# EAGLE schematic USB_Dimensioned (EAGLE 7.6.0)
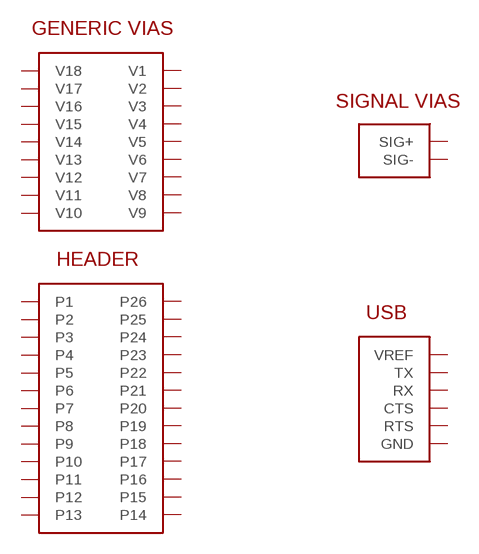
[diagram p0: schematic, sheet 1]

## Parts
U$1  TEMPLATE_USBRAW  [USB_TEMPLATE_RAW]
Unconnected: U$1.+(SIG+) U$1.+@1(SIG+) U$1.+@2(SIG+) U$1.+@3(SIG+) U$1.+@4(SIG+) U$1.+@5(SIG+) U$1.+@6(SIG+) U$1.+@7(SIG+) U$1.+@8(SIG+) U$1.+@9(SIG+) U$1.-(SIG-) U$1.-@1(SIG-) U$1.-@2(SIG-) U$1.-@3(SIG-) U$1.-@4(SIG-) U$1.-@5(SIG-) U$1.-@6(SIG-) U$1.-@7(SIG-) U$1.-@8(SIG-) U$1.-@9(SIG-) U$1.CTS U$1.CTS1(CTS) U$1.CTS@2(CTS) U$1.GND U$1.GND1(GND) U$1.GND@2(GND) U$1.P1 U$1.P1@1(P1) U$1.P1@2(P1) U$1.P2 U$1.P2@1(P2) U$1.P2@2(P2) U$1.P3 U$1.P3@1(P3) U$1.P3@2(P3) U$1.P4 U$1.P4@1(P4) U$1.P4@2(P4) U$1.P5 U$1.P5@1(P5) U$1.P5@2(P5) U$1.P6 U$1.P6@1(P6) U$1.P6@2(P6) U$1.P7 U$1.P7@1(P7) U$1.P7@2(P7) U$1.P8 U$1.P8@1(P8) U$1.P8@2(P8) U$1.P9 U$1.P9@1(P9) U$1.P9@2(P9) U$1.P10 U$1.P10@1(P10) U$1.P10@2(P10) U$1.P11 U$1.P11@1(P11) U$1.P11@2(P11) U$1.P12 U$1.P12@1(P12) U$1.P12@2(P12) U$1.P13 U$1.P13@1(P13) U$1.P13@2(P13) U$1.P14 U$1.P14@1(P14) U$1.P14@2(P14) U$1.P15 U$1.P15@1(P15) U$1.P15@2(P15) U$1.P16 U$1.P16@1(P16) U$1.P16@2(P16) U$1.P17 U$1.P17@1(P17) U$1.P17@2(P17) U$1.P18 U$1.P18@1(P18) U$1.P18@2(P18) U$1.P19 U$1.P19@1(P19) U$1.P19@2(P19) U$1.P20 U$1.P20@1(P20) U$1.P20@2(P20) U$1.P21 U$1.P21@1(P21) U$1.P21@2(P21) U$1.P22 U$1.P22@1(P22) U$1.P22@2(P22) U$1.P23 U$1.P23@1(P23) U$1.P23@2(P23) U$1.P24 U$1.P24@1(P24) U$1.P24@2(P24) U$1.P25 U$1.P25@1(P25) U$1.P25@2(P25) U$1.P26 U$1.P26@1(P26) U$1.P26@2(P26) U$1.RTS U$1.RTS1(RTS) U$1.RTS@2(RTS) U$1.RX U$1.RX1(RX) U$1.RX@2(RX) U$1.TX U$1.TX1(TX) U$1.TX@2(TX) U$1.VIA1(V1) U$1.VIA2(V2) U$1.VIA3(V3) U$1.VIA4(V4) U$1.VIA5(V5) U$1.VIA6(V6) U$1.VIA7(V7) U$1.VIA8(V8) U$1.VIA9(V9) U$1.VIA10(V10) U$1.VIA11(V11) U$1.VIA12(V12) U$1.VIA13(V13) U$1.VIA14(V14) U$1.VIA15(V15) U$1.VIA16(V16) U$1.VIA17(V17) U$1.VIA18(V18) U$1.VREF U$1.VREF1(VREF) U$1.VREF@2(VREF)

## Library data of the parts
U$1 = voltera_EAGLE_community_lib:TEMPLATE_USB